# Altium schematic sheet TPS65131.SchDoc
size A4
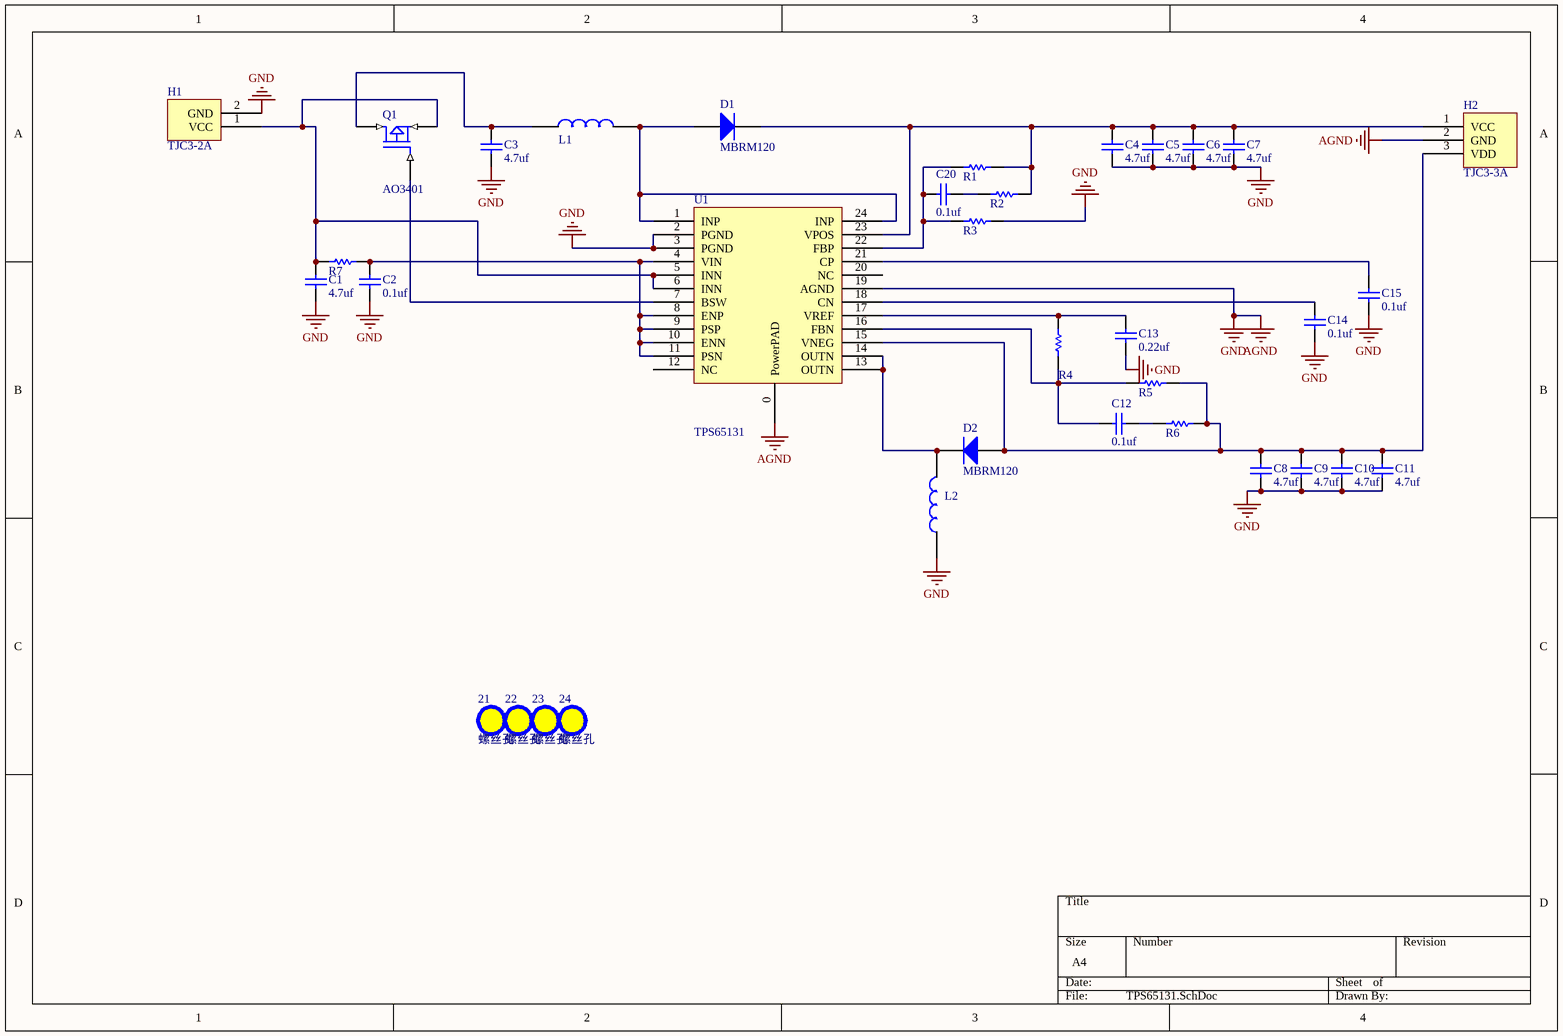
[diagram p0: TPS65131.SchDoc]

## Parts
21  螺丝孔  [固定过孔]
22  螺丝孔  [固定过孔]
23  螺丝孔  [固定过孔]
24  螺丝孔  [固定过孔]
C1  值: 4.7uf  [0805]  (hidden comment: Cap1)
C2  值: 0.1uf  [0805]  (hidden comment: Cap1)
C3  值: 4.7uf  [0805]  (hidden comment: Cap1)
C4  值: 4.7uf  [0805]  (hidden comment: Cap1)
C5  值: 4.7uf  [0805]  (hidden comment: Cap1)
C6  值: 4.7uf  [0805]  (hidden comment: Cap1)
C7  值: 4.7uf  [0805]  (hidden comment: Cap1)
C8  值: 4.7uf  [0805]  (hidden comment: Cap1)
C9  值: 4.7uf  [0805]  (hidden comment: Cap1)
C10  值: 4.7uf  [0805]  (hidden comment: Cap1)
C11  值: 4.7uf  [0805]  (hidden comment: Cap1)
C12  值: 0.1uf  [0805]  (hidden comment: Cap1)
C13  值: 0.22uf  [0805]  (hidden comment: Cap1)
C14  值: 0.1uf  [0805]  (hidden comment: Cap1)
C15  值: 0.1uf  [0805]  (hidden comment: Cap1)
C20  值: 0.1uf  [0805]  (hidden comment: Cap1)
D1  MBRM120  [SMB]
D2  MBRM120  [SMB]
H1  TJC3-2A  [TJC3-2A]
H2  TJC3-3A  [TJC3-3A]
L1  SMD  [功率电感-12x12 - duplicate]  (value not drawn)
L2  SMD  [功率电感-12x12 - duplicate]  (value not drawn)
Q1  AO3401  [SOT-23]
R1  RES  [0805]  (value not drawn)
R2  RES  [0805]  (value not drawn)
R3  RES  [0805]  (value not drawn)
R4  RES  [0805]  (value not drawn)
R5  RES  [0805]  (value not drawn)
R6  RES  [0805]  (value not drawn)
R7  RES  [0805]  (value not drawn)
U1  TPS65131  [LC-QFN-24_4x4x05P]

## Nets
AGND: C1.1 C2.1 C3.1 C4.1 C5.1 C6.1 C7.1 C8.1 C9.1 C10.1 C11.1 C13.2 C14.2 C15.2 H1.2(GND) H2.2(GND) L2.1 R3.2 U1.0(PowerPAD) U1.2(PGND) U1.3(PGND) U1.19(AGND)  [also labelled GND]
NetC1_2: C1.2 H1.1(VCC) Q1.3(S) R7.1 U1.5(INN) U1.6(INN)
NetC2_2: C2.2 R7.2 U1.4(VIN) U1.8(ENP) U1.9(PSP) U1.10(ENN) U1.11(PSN)
NetC3_2: C3.2 L1.1 Q1.2(D)
NetC4_2: C4.2 C5.2 C6.2 C7.2 D1.2(K) H2.1(VCC) R1.2 R2.2 U1.23(VPOS)
NetC8_2: C8.2 C9.2 C10.2 C11.2 D2.1(A) H2.3(VDD) R5.1 R6.1 U1.15(VNEG)
NetC12_1: C12.1 R6.2
NetC12_2: C12.2 R4.1 R5.2 U1.16(FBN)
NetC13_1: C13.1 R4.2 U1.17(VREF)
NetC14_1: C14.1 U1.18(CN)
NetC15_1: C15.1 U1.21(CP)
NetC20_1: C20.1 R1.1 R3.1 U1.22(FBP)
NetC20_2: C20.2 R2.1
NetD1_1: D1.1(A) L1.2 U1.1(INP) U1.24(INP)
NetD2_2: D2.2(K) L2.2 U1.13(OUTN) U1.14(OUTN)
NetQ1_1: Q1.1(G) U1.7(BSW)

Not connected (* = marked no-connect by the designer): U1 12(NC) 20(NC)

## Library data of the parts
L1 L2 = 功率电感
R1-R7 = RES: 值: 1k